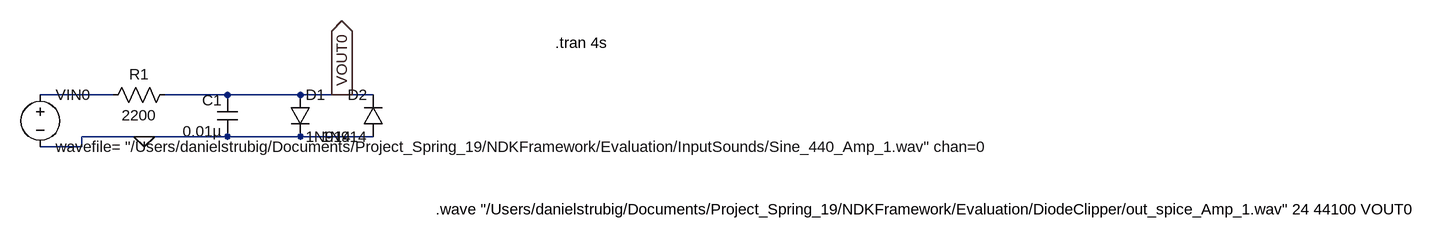
[diagram p0: schematic DiodeClipper.asc]
DiodeClipper.asc, the LTspice schematic file:
Version 4
SHEET 1 2188 680
WIRE 112 272 0 272
WIRE 288 272 192 272
WIRE 400 272 288 272
WIRE 464 272 400 272
WIRE 512 272 464 272
WIRE 160 336 64 336
WIRE 288 336 160 336
WIRE 400 336 288 336
WIRE 512 336 400 336
WIRE 64 352 64 336
WIRE 64 352 0 352
FLAG 160 336 0
FLAG 464 272 VOUT0
IOPIN 464 272 Out
SYMBOL voltage 0 256 R0
SYMATTR InstName VIN0
SYMATTR Value wavefile= "/Users/danielstrubig/Documents/Project_Spring_19/NDKFramework/Evaluation/InputSounds/Sine_440_Amp_1.wav" chan=0
SYMBOL diode 384 272 R0
SYMATTR InstName D1
SYMATTR Value 1N914
SYMBOL diode 528 336 R180
WINDOW 0 24 64 Left 2
WINDOW 3 24 0 Left 2
SYMATTR InstName D2
SYMATTR Value 1N914
SYMBOL res 208 256 R90
WINDOW 0 0 56 VBottom 2
WINDOW 3 32 56 VTop 2
SYMATTR InstName R1
SYMATTR Value 2200
SYMBOL cap 304 336 R180
WINDOW 0 24 56 Left 2
WINDOW 3 24 8 Left 2
SYMATTR InstName C1
SYMATTR Value 0.01µ
TEXT 608 448 Left 2 !.wave "/Users/danielstrubig/Documents/Project_Spring_19/NDKFramework/Evaluation/DiodeClipper/out_spice_Amp_1.wav" 24 44100 VOUT0
TEXT 792 192 Left 2 !.tran 4s

The netlist it stands for:
* DiodeClipper.asc
VIN0 N001 0 wavefile= "/Users/danielstrubig/Documents/Project_Spring_19/NDKFramework/Evaluation/InputSounds/Sine_440_Amp_1.wav" chan=0
D1 VOUT0 0 1N914
D2 0 VOUT0 1N914
R1 VOUT0 N001 2200
C1 0 VOUT0 0.01µ
.model D D
.lib standard.dio
.wave "/Users/danielstrubig/Documents/Project_Spring_19/NDKFramework/Evaluation/DiodeClipper/out_spice_Amp_1.wav" 24 44100 VOUT0
.tran 4s
.backanno
.end